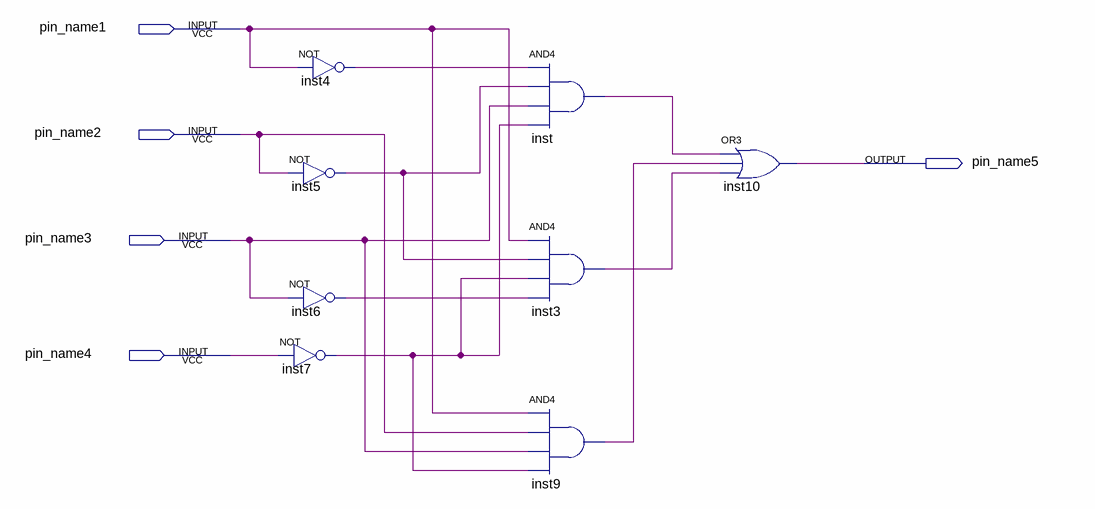
[diagram p0: schematic sheet]
// Quartus schematic d (2022_05_22 18_19_10 UTC).bdf as structural Verilog: 8 symbols, 5 pins
module \d_(2022_05_22_18_19_10_UTC)  (
  input  pin_name1,
  input  pin_name2,
  input  pin_name3,
  input  pin_name4,
  output pin_name5
);

  wire inst3_out, inst4_out, inst5_out, inst6_out, inst7_out, inst9_out, inst_out;

  not inst4 (inst4_out, pin_name1);
  not inst5 (inst5_out, pin_name2);
  not inst6 (inst6_out, pin_name3);
  not inst7 (inst7_out, pin_name4);
  and inst (inst_out, inst4_out, inst5_out, pin_name3, inst7_out);
  and inst3 (inst3_out, pin_name1, inst5_out, inst7_out, inst6_out);
  and inst9 (inst9_out, pin_name1, pin_name2, pin_name3, inst7_out);
  or inst10 (pin_name5, inst_out, inst9_out, inst3_out);
endmodule
